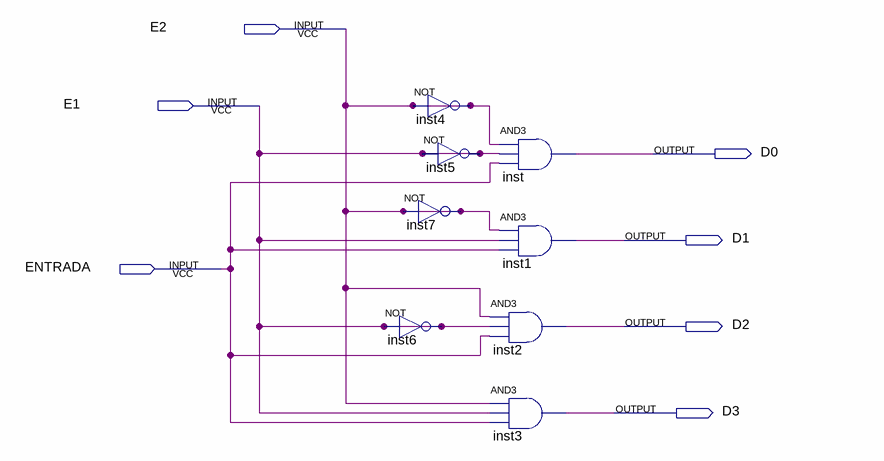
[diagram p0: schematic sheet]
// Quartus schematic Dmux_4x1.bdf as structural Verilog: 8 symbols, 7 pins
module Dmux_4x1 (
  input  E2,
  input  E1,
  input  ENTRADA,
  output D0,
  output D1,
  output D2,
  output D3
);

  not inst4 (E2, E2);
  not inst5 (E1, E1);
  not inst7 (E2, E2);
  not inst6 (E1, E1);
  and inst (D0, E2, E1, ENTRADA);
  and inst1 (D1, E2, E1, ENTRADA);
  and inst2 (D2, E2, E1, ENTRADA);
  and inst3 (D3, E2, E1, ENTRADA);
endmodule
